# EAGLE design Volterra Carriage Board (EAGLE 9.1.3)
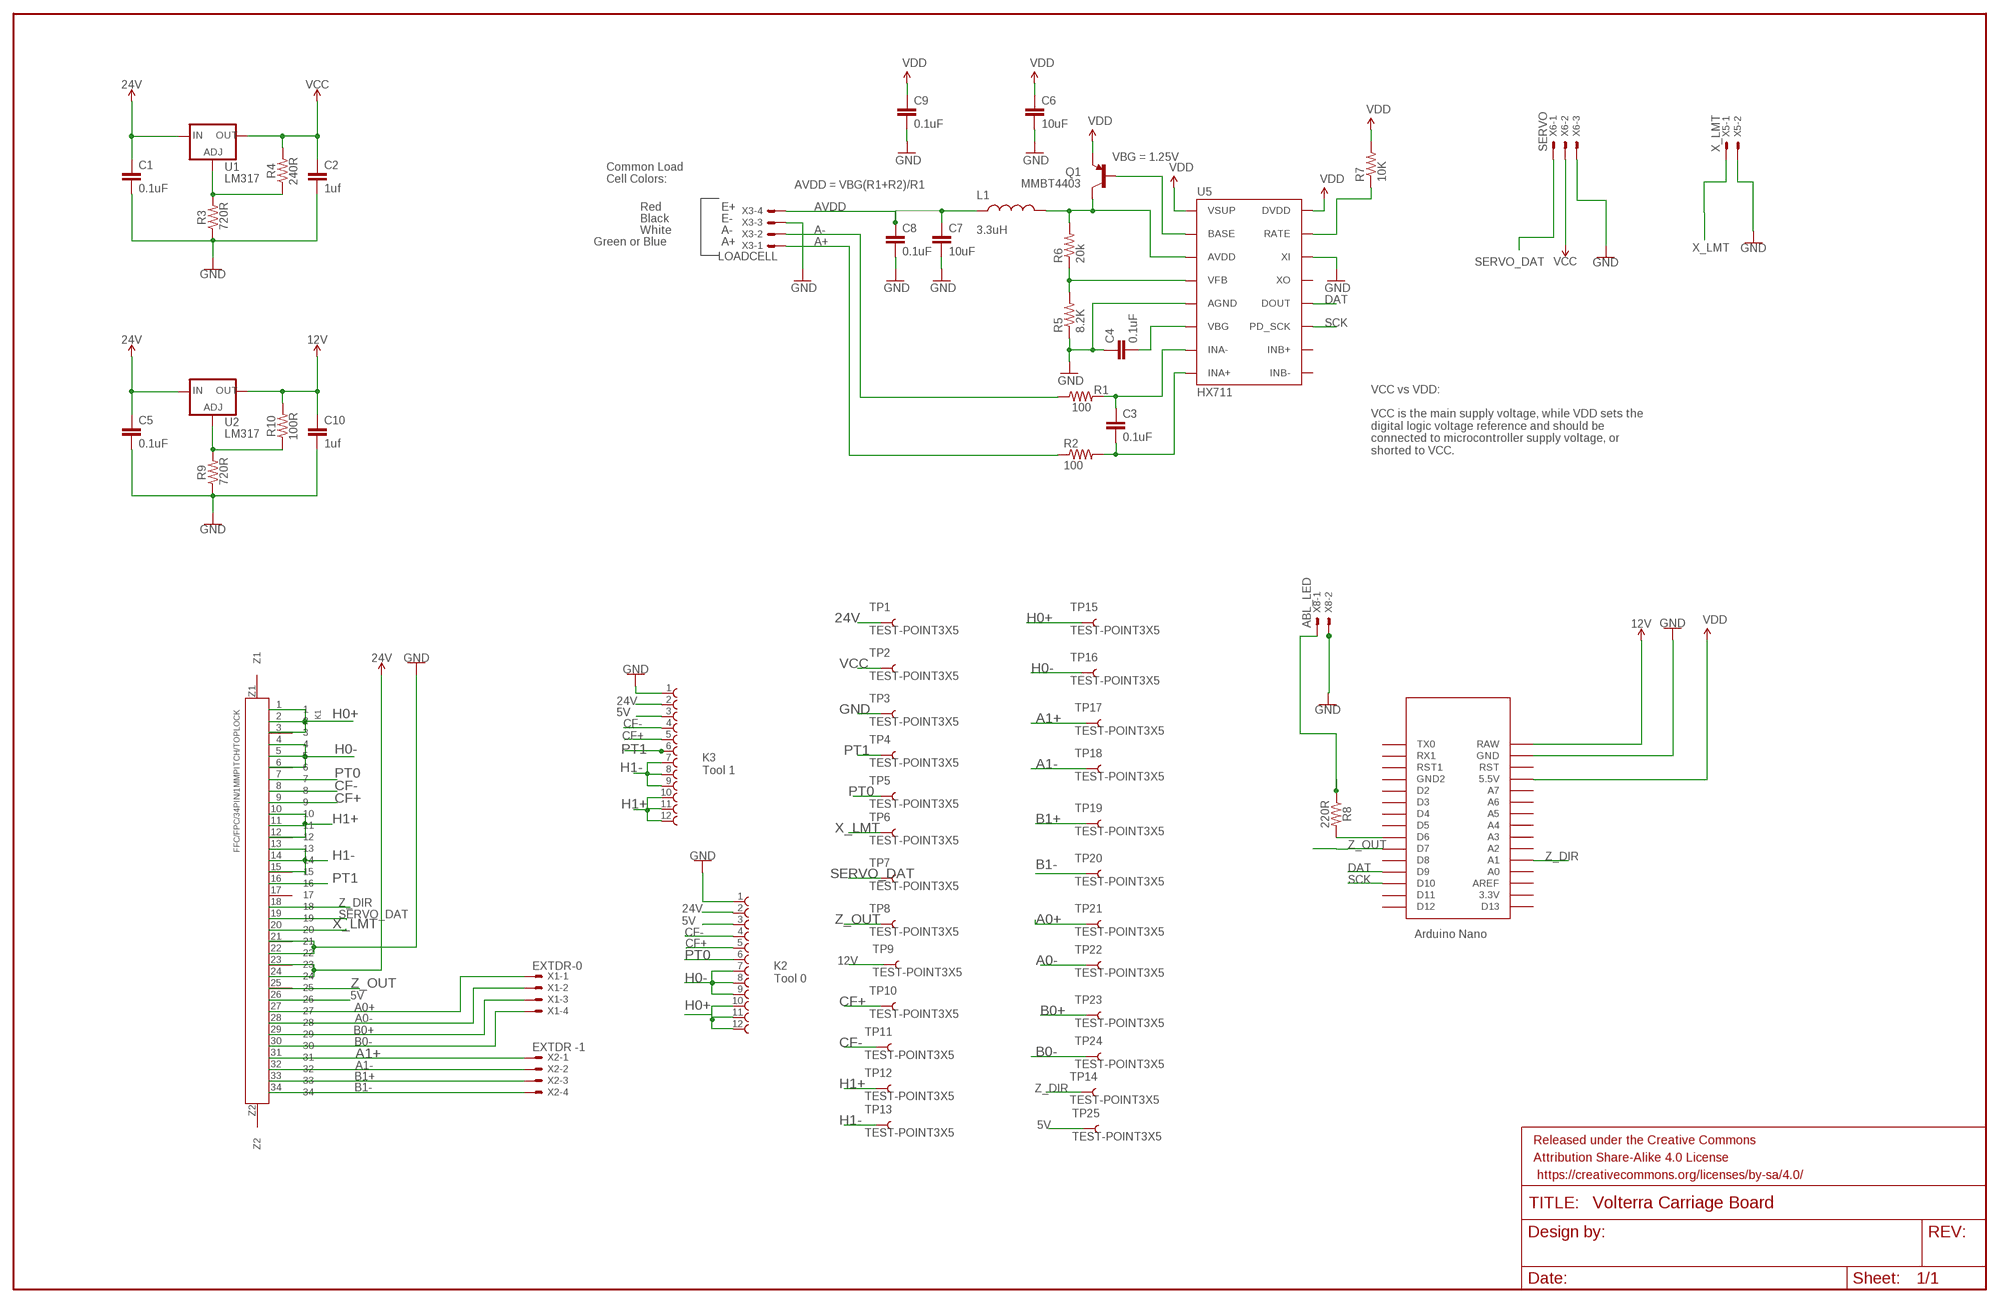
[diagram p0: schematic, sheet 1]

## Parts
C1  0.1uF  9.0PF-0603-50V-10%  [0603]
C2  1uf  9.0PF-0603-50V-10%  [0603]
C3  0.1uF  0.1UF-25V-5%(0603)  [0603-CAP]
C4  0.1uF  0.1UF-25V-5%(0603)  [0603-CAP]
C5  0.1uF  9.0PF-0603-50V-10%  [0603]
C6  10uF  10UF50V20%(1210)  [1210]
C7  10uF  10UF50V20%(1210)  [1210]
C8  0.1uF  0.1UF-25V-5%(0603)  [0603-CAP]
C9  0.1uF  0.1UF-25V-5%(0603)  [0603-CAP]
C10  1uf  9.0PF-0603-50V-10%  [0603]
FRAME1  FRAME-LEDGER  [CREATIVE_COMMONS]
K1  FFC/FPC/34PIN/1MMPITCH/TOPLOCK  [34PIN/1MMPITCH/FFC/FPC]
K2  Tool 0  68611214122  [68611214122]
K3  Tool 1  68611214122  [68611214122]
L1  3.3uH  INDUCTOR0805-IND  [0805]
Q1  MMBT4403  TRANSISTOR_PNPMMBT4403  [SOT23-3]
R1  100  100OHM-1/10W-1%(0603)  [0603-RES]
R2  100  100OHM-1/10W-1%(0603)  [0603-RES]
R3  720R  RESISTOR0603  [0603]
R4  240R  RESISTOR0603  [0603]
R5  8.2K  8.2KOHM-1/10W-5%(0603)  [0603-RES]
R6  20k  20KOHM1/10W1%(0603)  [0603-RES]
R7  10K  10KOHM-1/10W-1%(0603)0603  [0603-RES]
R8  220R  RESISTOR0603  [0603]
R9  720R  RESISTOR0603  [0603]
R10  100R  RESISTOR0603  [0603]
TP1  TEST-POINT3X5  [PAD.03X.05]
TP2  TEST-POINT3X5  [PAD.03X.05]
TP3  TEST-POINT3X5  [PAD.03X.05]
TP4  TEST-POINT3X5  [PAD.03X.05]
TP5  TEST-POINT3X5  [PAD.03X.05]
TP6  TEST-POINT3X5  [PAD.03X.05]
TP7  TEST-POINT3X5  [PAD.03X.05]
TP8  TEST-POINT3X5  [PAD.03X.05]
TP9  TEST-POINT3X5  [PAD.03X.05]
TP10  TEST-POINT3X5  [PAD.03X.05]
TP11  TEST-POINT3X5  [PAD.03X.05]
TP12  TEST-POINT3X5  [PAD.03X.05]
TP13  TEST-POINT3X5  [PAD.03X.05]
TP14  TEST-POINT3X5  [PAD.03X.05]
TP15  TEST-POINT3X5  [PAD.03X.05]
TP16  TEST-POINT3X5  [PAD.03X.05]
TP17  TEST-POINT3X5  [PAD.03X.05]
TP18  TEST-POINT3X5  [PAD.03X.05]
TP19  TEST-POINT3X5  [PAD.03X.05]
TP20  TEST-POINT3X5  [PAD.03X.05]
TP21  TEST-POINT3X5  [PAD.03X.05]
TP22  TEST-POINT3X5  [PAD.03X.05]
TP23  TEST-POINT3X5  [PAD.03X.05]
TP24  TEST-POINT3X5  [PAD.03X.05]
TP25  TEST-POINT3X5  [PAD.03X.05]
U1  LM317  V_REG_317SMD  [SOT223]
U2  LM317  V_REG_317SMD  [SOT223]
U5  HX711  HX711HX711  [SO16]
U$1  NANO  [NANO]
X1  EXTDR-0  JST-XH-04-PIN-LONG-PAD  [JST-XH-04-PACKAGE-LONG-PAD]
X2  EXTDR -1  JST-XH-04-PIN-LONG-PAD  [JST-XH-04-PACKAGE-LONG-PAD]
X3  LOADCELL  JST-XH-04-PIN-LONG-PAD  [JST-XH-04-PACKAGE-LONG-PAD]
X5  X_LMT  JST-XH-02-PIN-LONG-PAD  [JST-XH-02-PACKAGE-LONG-PAD]
X6  SERVO  JST-XH-03-PIN-LONG-PAD  [JST-XH-03-PACKAGE-LONG-PAD]
X8  ABL_LED  JST-XH-02-PIN-LONG-PAD  [JST-XH-02-PACKAGE-LONG-PAD]

## Nets
5V: K1.26 K2.3 K3.3 TP25.P$1
12V: C10.1 R10.2 TP9.P$1 U2.2(OUT) U$1.RAW
24V: C1.1 C5.1 K1.23 K1.24 K2.2 K3.2 TP1.P$1 U1.3(IN) U2.3(IN)
A0+: K1.27 TP21.P$1 X1.1
A0-: K1.28 TP22.P$1 X1.2
A1+: K1.31 TP17.P$1 X2.1
A1-: K1.32 TP18.P$1 X2.2
A+: R2.1 X3.1
A-: R1.1 X3.2
ADJ: R3.2 R4.1 U1.1(ADJ)
ADJ1: R9.2 R10.1 U2.1(ADJ)
AVDD: C7.1 C8.1 L1.1 X3.4
B0+: K1.29 TP23.P$1 X1.3
B0-: K1.30 TP24.P$1 X1.4
B1+: K1.33 TP19.P$1 X2.3
B1-: K1.34 TP20.P$1 X2.4
CF+: K1.9 K2.5 K3.5 TP10.P$1
CF-: K1.8 K2.4 K3.4 TP11.P$1
DAT: U5.12(DOUT) U$1.D9
GND: C1.2 C2.2 C4.1 C5.2 C6.2 C7.2 C8.2 C9.2 C10.2 K1.21 K1.22 K2.1 K3.1 R3.1 R5.1 R9.1 TP3.P$1 U5.5(AGND) U5.14(XI) U$1.GND X3.3 X5.2 X6.3 X8.2
H0+: K1.1 K1.2 K1.3 K2.10 K2.11 K2.12 TP15.P$1
H0-: K1.4 K1.5 K1.6 K2.7 K2.8 K2.9 TP16.P$1
H1+: K1.10 K1.11 K1.12 K3.10 K3.11 K3.12 TP12.P$1
H1-: K1.13 K1.14 K1.15 K3.7 K3.8 K3.9 TP13.P$1
N$1: R8.2 U$1.D6
N$2: R7.1 U5.15(RATE)
N$3: C3.1 R1.2 U5.7(INA-)
N$4: Q1.1(B) U5.2(BASE)
N$5: L1.2 Q1.3(C) R6.2 U5.3(AVDD)
N$6: R5.2 R6.1 U5.4(VFB)
N$7: C4.2 U5.6(VBG)
N$8: C3.2 R2.2 U5.8(INA+)
N$14: R8.1 X8.1
PT0: K1.7 K2.6 TP5.P$1
PT1: K1.16 K3.6 TP4.P$1
SCK: U5.11(PD_SCK) U$1.D10
SERVO_DAT: K1.19 TP7.P$1 X6.1
VCC: C2.1 R4.2 TP2.P$1 U1.2(OUT) X6.2
VDD: C6.1 C9.1 Q1.2(E) R7.2 U5.1(VSUP) U5.16(DVDD) U$1.5V(5.5V)
X_LMT: K1.20 TP6.P$1 X5.1
Z_DIR: K1.18 TP14.P$1 U$1.A1
Z_OUT: K1.25 TP8.P$1 U$1.D7
Unconnected: K1.17 K1.Z1 K1.Z2 U5.9(INB-) U5.10(INB+) U5.13(XO) U$1.3.3V U$1.A0 U$1.A2 U$1.A3 U$1.A4 U$1.A5 U$1.A6 U$1.A7 U$1.AREF U$1.D2 U$1.D3 U$1.D4 U$1.D5 U$1.D8 U$1.D11 U$1.D12 U$1.D13 U$1.GND1(GND2) U$1.ICSP1 U$1.ICSP2 U$1.ICSP3 U$1.ICSP4 U$1.ICSP5 U$1.ICSP6 U$1.RST U$1.RST1 U$1.RX1 U$1.TX0

## Notes on the sheet
- VBG = 1.25V
- Common Load
  Cell Colors:
- AVDD = VBG(R1+R2)/R1
- Red | E+
- Black | E-
- White | A-
- Green or Blue | A+
- VCC vs VDD:
  
  VCC is the main supply voltage, while VDD sets the
  digital logic voltage reference and should be
  connected to microcontroller supply voltage, or
  shorted to VCC.
- C:/Users/Vijay/Dropbox/FracktalWorks/Design & Marketing Colaterals/Box Logo.bmp | C:/Users/Vijay/Dropbox/FracktalWorks/Design & Marketing Colaterals/Box Logo.bmp

## Library data of the parts
C1 C2 C5 C10 = SparkFun-Capacitors:9.0PF: 9.0pF ceramic capacitors A capacitor is a passive two-terminal electrical component used to store electrical energy temporarily in an electric field.; PROD_ID: CAP-09341; VALUE: 9.0pF
C3 C4 C8 C9 = SparkFun-Capacitors:0.1UF-25V-5%(0603): CAP-08604; PROD_ID: CAP-08604
C6 C7 = SparkFun-Capacitors:10UF50V20%(1210): CAP-09824; PROD_ID: CAP-09824
FRAME1 = SparkFun-Aesthetics:FRAME-LEDGER: Schematic Frame - Ledger Standard 11x14 US Ledger frame
K1 = FracktalWorks_Eagle_Library:FFC/FPC/34PIN/1MMPITCH/TOPLOCK
K2 K3 = Wurth_Elektronik_Electromechanic_FPC_Connectors_&_Flat_Flexible_Cable_rev15b:68611214122: WR-FPC 1.00mm SMT ZIF Horizontal Top Contact, 12 Pins=>Code : Con_FPC_ZIF_1.00_68611214122 <http://katalog.we-online.de/media/images/eican/Con_FPC_ZIF_1.00_6861xx14122_pf2.jpg> Details see: http://katalog.we-online.de/en/em/686_1xx_141_22 Created 2014-07-09, Karrer Zheng 2014 (C) Würth Elektronik
L1 = SparkFun-Passives:INDUCTOR: Inductors Basic Inductor/Choke - 0603 and 1206. Footprints are not proven and vary greatly between part numbers. INDUCTOR POWER 3.3UH 4.0A SMD 0.197" L x 0.197" W x 0.177" H (5.00mm x 5.00mm x 4.50mm); PROD_ID: NDUC-13076
Q1 = SparkFun-DiscreteSemi:TRANSISTOR_PNP: Generic PNP BJT Double check pinouts against datasheets- not all devices are the same! MMBT3906 - 40V 200mA SOT-23 (TRANS-08052) MMBT4403 - 40V 600mA SOT-23 (TRANS-09245); PROD_ID: TRANS-09245
R1 R2 = SparkFun-Resistors:100OHM-1/10W-1%(0603): RES-07863; PROD_ID: RES-07863
R3 R4 R8-R10 = SparkFun-Resistors:RESISTOR: Generic Resistor Package
R5 = SparkFun-Resistors:8.2KOHM-1/10W-5%(0603): RES-10646; PROD_ID: RES-10646
R6 = SparkFun-Resistors:20KOHM1/10W1%(0603): RES-09383; PROD_ID: RES-09383
R7 = SparkFun-Resistors:10KOHM-1/10W-1%(0603): RES-00824; PROD_ID: RES-00824
TP1-TP25 = SparkFun-Connectors:TEST-POINT: SparkFun Test Points Bare copper test points for troubleshooting or In-Circuit-Testing. These are used by our Production team for verifying production board runs using pogo-pins on test beds. SparkFun Products: SparkFun LSM9DS1 Breakout <https://www.sparkfun.com/products/13284> SparkFun PSOC <https://www.sparkfun.com/products/13714> SparkFun Load Cell Amplifier <https://www.sparkfun.com/products/13879>
U1 U2 = SparkFun-IC-Power:V_REG_317: Voltage Regulator Standard LM317 adjustable voltage regulator. AOI (Adjust Output Input). Google 'LM317 Calculator' for easy to use app to get the two resistor values needed. 240/720 for 5V output. 240/390 for 3.3V output. Spark Fun Electronics SKU : COM-00527
U5 = Testing:HX711; PROD_ID: IC-12445
U$1 = Arduino-clone:NANO: Arduino Nano
X1-X3 = Rembrandt Electronics - JST XH Connectors v1-0:JST-XH-04-PIN: JST XH Connector 2 Pin Wire to board connector. Pitch: 2,54 mm, (0.100") Number of pins: 4 Created by Rembrandt Electronics www.rembrandtelectronics.com
X5 X8 = Rembrandt Electronics - JST XH Connectors v1-0:JST-XH-02-PIN: JST XH Connector 2 Pin Wire to board connector. Pitch: 2,54 mm, (0.100") Number of pins: 2 Created by Rembrandt Electronics www.rembrandtelectronics.com
X6 = Rembrandt Electronics - JST XH Connectors v1-0:JST-XH-03-PIN: JST XH Connector 2 Pin Wire to board connector. Pitch: 2,54 mm, (0.100") Number of pins: 3 Created by Rembrandt Electronics www.rembrandtelectronics.com

## Net classes
0 default: width 0.305 mm

## Board
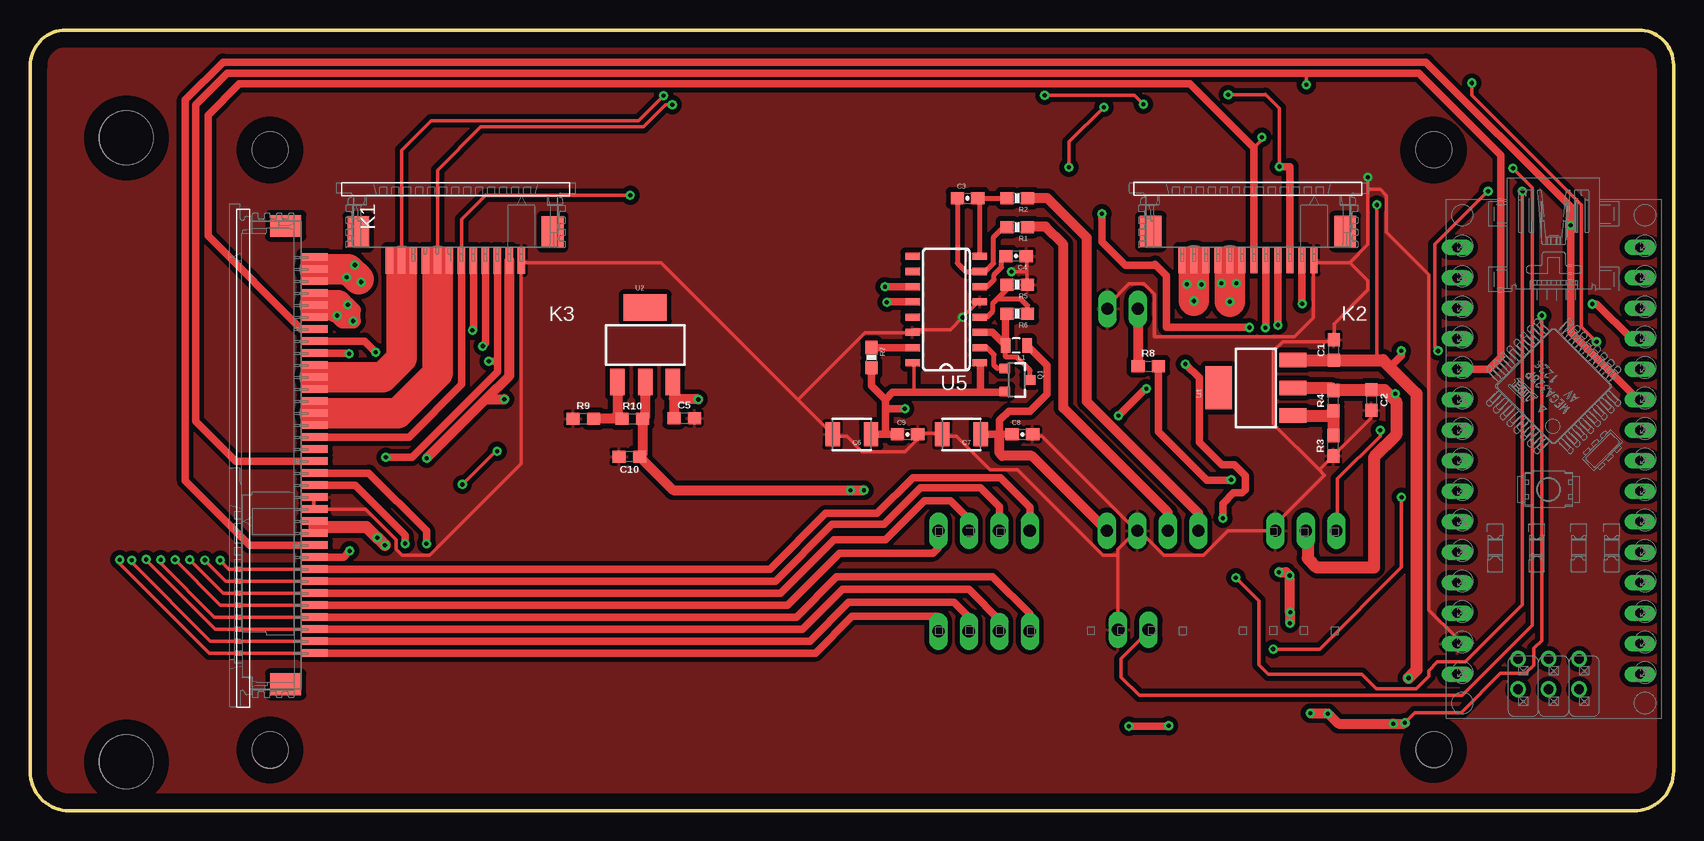
[diagram p1: board, top side]
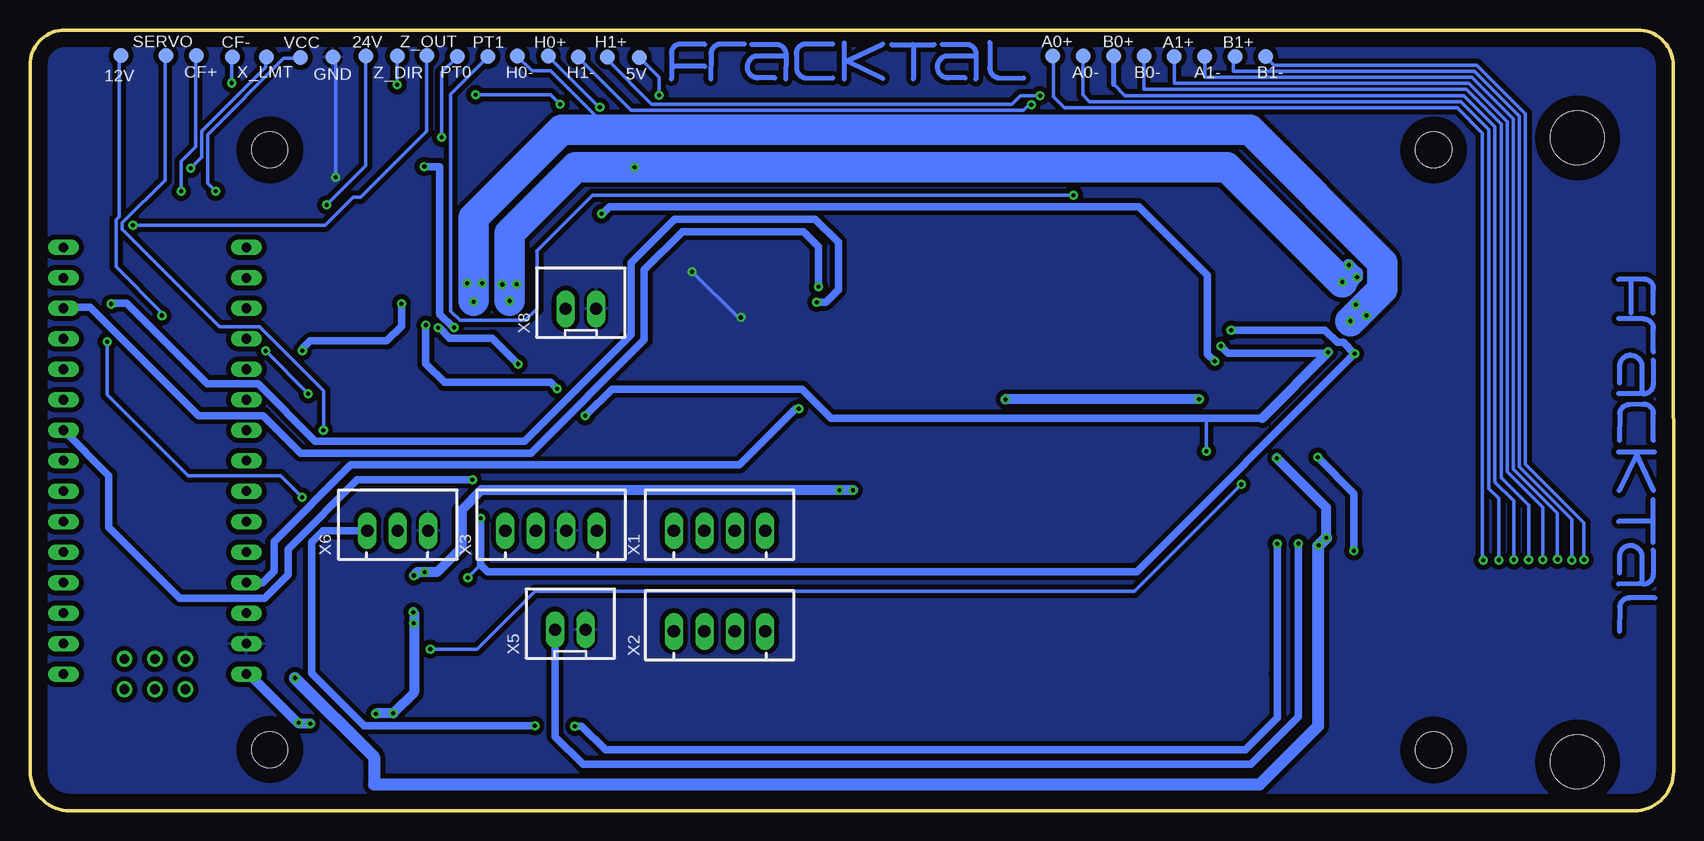
[diagram p2: board, bottom side, seen from below]

Size 137.01 x 65.07 mm. Coordinates in mm from the lower left corner, seen from the top.
Outline: 3,65.07 134.09,65.07 arc-90 137.01,62.15 137.01,3.33 arc-90 133.68,0 3.3,0 arc-90 0,3.3 0.03,62.1 arc-90 3,65.07
Copper layers (1*16): Top 0.035mm / dielectric 1.5mm / Bottom 0.035mm
Design rules "LionCircuits *": minimum track width 8mil, minimum drill 0.35mm, track to track 8mil, track to pad 8mil, pad to pad 8mil, via to via 8mil, smd to smd 8mil, copper to edge 50mil, drill to drill 10mil, minimum pad ring 10mil, minimum via ring 8mil, stop-mask expansion 4mil, vias tented up to drill 0mil, thermal gap 10mil
Holes 3 mm at 20.02,55.09 20.02,5.08 117.02,5.11 117.02,55.09
Holes 4.5 mm at 8.03,56.08 8.03,4.09

### Footprints (pad centres in the part's own frame; a part is rotated, then mirrored left to right if it is on the bottom)
0603 = smd 1.1 x 1: 1 -0.85,0; 2 0.85,0
0603-CAP = smd 1.1 x 1: 1 -0.85,0; 2 0.85,0
1210 = smd 1.2 x 2: 1 -1.6,0; 2 1.6,0
34PIN/1MMPITCH/FFC/FPC = smd 0.6 x 2.2: 1 -14.43,2.1; 2 -13.43,2.1; 3 -12.43,2.1; 4 -11.43,2.1; 5 -10.43,2.1; 6 -9.43,2.1; 7 -8.43,2.1; 8 -7.43,2.1; 9 -6.43,2.1; 10 -5.43,2.1; 11 -4.43,2.1; 12 -3.43,2.1; 13 -2.43,2.1; 14 -1.43,2.1; 15 -0.43,2.1; 16 0.57,2.1; 17 1.57,2.1; 18 2.57,2.1; 19 3.57,2.1; 20 4.57,2.1; 21 5.57,2.1; 22 6.57,2.1; 23 7.57,2.1; 24 8.57,2.1; 25 9.57,2.1; 26 10.57,2.1; 27 11.57,2.1; 28 12.57,2.1; 29 13.57,2.1; 30 14.57,2.1; 31 15.57,2.1; 32 16.57,2.1; 33 17.57,2.1; 34 18.57,2.1 | smd 1.8 x 2.6: Z1 -17.03,-0.3; Z2 21.17,-0.3
68611214122 = smd 0.6 x 2.2: 1 -8.5,1.1; 2 -7.5,1.1; 3 -6.5,1.1; 4 -5.5,1.1; 5 -4.5,1.1; 6 -3.5,1.1; 7 -2.5,1.1; 8 -1.5,1.1; 9 -0.5,1.1; 10 0.5,1.1; 11 1.5,1.1; 12 2.5,1.1 | smd 1.8 x 2.6: Z1 -11.1,-1.3; Z2 5.1,-1.3
0805 = smd 0.8 x 1.2: 1 -0.9,0; 2 0.9,0
SOT23-3 = smd 0.8 x 0.9: 1 -0.95,-1; 2 0.95,-1; 3 0,1.1
0603-RES = smd 1.1 x 1: 1 -0.85,0; 2 0.85,0
PAD.03X.05 = smd 1.27 x 1.27: P$1 0,0
SOT223 = smd 1.219 x 2.235: 1 -2.311,-3.099; 2 0,-3.099; 3 2.311,-3.099 | smd 3.6 x 2.2: 4 0,3.099
SO16 = smd 0.6 x 1.2: 1 -4.445,-2.8; 2 -3.175,-2.8; 3 -1.905,-2.8; 4 -0.635,-2.8; 5 0.635,-2.8; 6 1.905,-2.8; 7 3.175,-2.8; 8 4.445,-2.8; 9 4.445,2.8; 10 3.175,2.8; 11 1.905,2.8; 12 0.635,2.8; 13 -0.635,2.8; 14 -1.905,2.8; 15 -3.175,2.8; 16 -4.445,2.8
NANO = drill 0.8 long: 3.3V -10.16,24.13; 5V -10.16,-1.27; A0 -10.16,19.05; A1 -10.16,16.51; A2 -10.16,13.97; A3 -10.16,11.43; A4 -10.16,8.89; A5 -10.16,6.35; A6 -10.16,3.81; A7 -10.16,1.27; AREF -10.16,21.59; D2 5.08,1.27; D3 5.08,3.81; D4 5.08,6.35; D5 5.08,8.89; D6 5.08,11.43; D7 5.08,13.97; D8 5.08,16.51; D9 5.08,19.05; D10 5.08,21.59; D11 5.08,24.13; D12 5.08,26.67; D13 -10.16,26.67; GND -10.16,-6.35; GND1 5.08,-1.27; RAW -10.16,-8.89; RST -10.16,-3.81; RST1 5.08,-3.81; RX1 5.08,-6.35; TX0 5.08,-8.89 | drill 0.8: ICSP1 -5.08,-10.16; ICSP2 -5.08,-7.62; ICSP3 -2.54,-10.16; ICSP4 -2.54,-7.62; ICSP5 0,-10.16; ICSP6 0,-7.62
JST-XH-04-PACKAGE-LONG-PAD = drill 1.016 long: 1 -3.81,0; 2 -1.27,0; 3 1.27,0; 4 3.81,0
JST-XH-02-PACKAGE-LONG-PAD = drill 1.016 long: 1 -1.27,0; 2 1.27,0
JST-XH-03-PACKAGE-LONG-PAD = drill 1.016 long: 1 -2.54,0; 2 0,0; 3 2.54,0

### Placement (x,y rotation side)
C1  108.69,38.4 90 top
C2  111.81,34.24 270 top
C3  78.16,51.05 0 top
C4  82.19,46.23 180 top
C5  54.53,32.74 0 top
C6  68.5,31.37 180 top
C7  77.65,31.37 180 top
C8  82.73,31.37 0 top
C9  73.15,31.37 0 top
C10  49.96,29.51 180 top
FRAME1  20.27,-8.61 0 top  (outside the outline)
K1  21.62,31.72 270 top
K2  98.53,46.99 180 top
K3  32.46,46.96 180 top
L1  82.22,38.79 180 top
Q1  82.25,35.92 270 top
R1  82.3,48.64 180 top
R2  82.3,51.05 180 top
R3  108.64,30.43 90 top
R4  108.66,34.19 90 top
R5  82.3,43.84 180 top
R6  82.3,41.43 180 top
R7  70.13,37.77 270 top
R8  93.22,37.06 0 top
R9  46.13,32.69 0 top
R10  50.22,32.66 0 top
TP1  109.02,62.89 0 bottom
TP2  114.48,62.79 0 bottom
TP3  111.76,62.81 0 bottom
TP4  98.83,62.87 0 bottom
TP5  101.37,62.87 0 bottom
TP6  117.3,62.84 180 bottom
TP7  125.68,62.97 180 bottom
TP8  103.94,62.94 180 bottom
TP9  129.41,62.94 0 bottom
TP10  123.14,62.94 180 bottom
TP11  120.14,62.81 180 bottom
TP12  88.87,62.81 0 bottom
TP13  91.31,62.81 0 bottom
TP14  106.4,62.89 180 bottom
TP15  93.8,62.89 0 bottom
TP16  96.39,62.89 0 bottom
TP17  41.63,62.87 180 bottom
TP18  39.09,62.87 180 bottom
TP19  36.55,62.87 180 bottom
TP20  34.01,62.87 180 bottom
TP21  51.74,62.92 180 bottom
TP22  49.2,62.92 180 bottom
TP23  46.66,62.92 180 bottom
TP24  44.12,62.92 180 bottom
TP25  86.23,62.79 0 bottom
U1  102.18,35.26 90 top
U2  51.28,38.84 0 top
U5  76.38,41.78 90 top
U$1  129.13,20.29 0 top
U$2  [FRACKTALLOGO]  4.67,32.31 270 bottom
U$3  [FRACKTALLOGO]  71.55,60.91 0 bottom
X1  79.53,23.34 0 bottom
X2  79.53,14.96 0 bottom
X3  93.57,23.34 0 bottom
X5  91.97,15.09 0 bottom
X6  106.35,23.34 0 bottom
X8  91.08,41.83 0 bottom

### Tracks (layer width: path | path; a pad name or v marks a point on that pad's centre or on a via)
5V  (via drill 0.35)
  Top 0.305: v104.14,53.7 104.14,58.57 103,59.72 102.97,59.69 v99.87,59.69 | v92.81,58.88 92.05,59.64 v84.58,59.64
  Top 0.61: 38.97,37.49 38.97,41.94 K3.3 | 38.97,37.49 38.28,37.49 v38.25,37.46 | v89.36,49.76 89.36,47.45 91.31,45.49 93.7,45.49 93.78,45.57 94.74,44.6 94.74,40.28 v101.65,40.28 | v104.14,53.7 105.03,53.7 K2.3 | K1.26 26.13,21.15 v26.64,21.67 | v29.67,29.46 31.85,29.46 38.97,36.58 38.97,37.49
  Bottom 0.305: v99.87,59.69 93.62,59.69 v92.81,58.88 | v84.58,59.64 84.58,61.14 TP25.P$1
  Bottom 0.61: v89.36,49.76 89.28,49.76 88.7,50.34 44.55,50.34 38.86,44.65 38.86,38.07 v38.25,37.46 | v104.14,53.7 102.84,53.7 102.84,41.38 101.75,40.28 v101.65,40.28 | v26.64,21.67 26.64,26.44 v29.67,29.46
12V  (via drill 0.35)
  Top 0.305: v126.01,41.27 126.01,14.2 125.35,13.54 125.35,12.14 124.66,11.46 122.58,11.46 119.3,8.18 115.42,8.18 114.83,7.59 v114.6,7.34
  Top 0.813: U2.2 51.28,32.88 R10.2 51.07,29.77 C10.1 53.61,26.72 v69.52,26.72 | v104.11,19.89 104.72,19.89 v105,19.61 105,16.61 v105.05,16.56 105.03,16.54 v105.03,15.65 | v106.73,8.13 108.2,8.13 109.07,7.26 v113.64,7.26 114.53,7.26 v114.6,7.34
  Bottom 0.305: TP9.P$1 129.57,62.71 129.57,49.5 129.82,49.25 129.82,45.34 126.01,41.53 v126.01,41.27
  Bottom 0.813: v105,19.61 104.72,19.89 103.07,19.89 101.04,21.92 101.04,25.07 99.39,26.72 v69.52,26.72 v68.4,26.72 | U$1.RAW 118.75,11.4 114.6,7.26 v113.64,7.26 | v105.05,16.56 105,16.51 105,9.86 v106.73,8.13 108.15,8.13 v108.18,8.1
24V  (via drill 0.35)
  Top 0.305: v112.27,50.5 112.27,38.07 112.79,37.55
  Top 0.61: K1.24 23.72,23.67 K1.23 | v114.3,38.35 114.3,37.92 113.36,36.98 | K2.2 106.03,42.28 v106.05,42.27
  Top 0.813: v33.07,29.39 37.97,34.29 | 37.97,34.29 39.96,36.28 K3.2 | U2.3 53.68,35.65 53.68,34.37 | 53.68,34.37 C5.1 | 37.97,34.29 39.52,34.29 v39.55,34.32 | v55.7,34.29 53.76,34.29 53.68,34.37
  Top 1.016: U1.3 108.67,37.57 C1.1 112.79,37.55 113.36,36.98 115.57,34.77 115.57,11.73 v114.91,11.07 | 23.72,23.67 28.04,23.67 v28.96,22.76 28.98,22.76 v29.59,22.15
  Bottom 0.305: TP1.P$1 109.02,53.75 v112.27,50.5
  Bottom 0.61: v106.05,42.27 106.05,40.39 107.26,39.17 113.64,39.17 114.3,38.51 v114.3,38.35
  Bottom 0.813: v28.96,22.76 28.96,25.27 v33.07,29.39 | v39.55,34.32 55.68,34.32 v55.7,34.29
  Bottom 1.016: v28.96,22.76 29.64,22.07 29.64,7.06 34.49,2.21 108.33,2.21 108.33,4.5 v114.91,11.07
A0+  (via drill 0.35)
  Top 0.305: K1.27 16.57,20.15 v15.85,20.88
  Top 0.61: K1.27 61.68,20.15 66.32,24.79 70.61,24.79 73.58,27.76 80.9,27.76 83.34,25.32 X1.1
  Bottom 0.305: 51.69,62.43 51.69,59.51 50.77,58.6 18.03,58.6 15.93,56.49 15.93,20.95 v15.85,20.88
  Bottom 0.406: 51.69,62.43 51.74,62.48 TP21.P$1
A0-  (via drill 0.35)
  Top 0.305: K1.28 16.33,19.15 v14.58,20.9
  Top 0.61: K1.28 62.13,19.15 66.85,23.88 71.2,23.88 74.24,26.92 79.22,26.92 80.8,25.35 X1.2
  Bottom 0.305: v14.58,20.9 14.58,26.03 15.39,26.85 15.39,56.77 17.73,59.11 48.69,59.11 49.25,59.66 49.25,62.86
  Bottom 0.406: 49.25,62.86 TP22.P$1
A1+  (via drill 0.35)
  Top 0.305: K1.31 15.37,16.15 10.9,20.62 v10.9,20.93
  Top 0.61: K1.31 63.88,16.15 67.23,19.51 80.24,19.51 83.34,16.41 X2.1
  Bottom 0.305: v10.9,20.93 10.9,25.3 13.87,28.27 13.87,57.45 17.05,60.63 41.61,60.63 41.61,62.84
  Bottom 0.406: 41.61,62.84 TP17.P$1
A1-  (via drill 0.35)
  Top 0.305: K1.32 15.45,15.15 9.66,20.94 v9.68,20.95
  Top 0.61: K1.32 64.41,15.15 67.72,18.47 78.26,18.47 80.95,15.77 80.95,15.11 X2.2
  Bottom 0.305: v9.68,20.95 9.68,24.8 13.36,28.48 13.36,57.66 16.84,61.14 39.07,61.14 39.09,61.16 TP18.P$1
A+
  Top 0.813: X3.1 97.38,24.82 88.09,34.11 88.09,47.78 84.81,51.05 R2.1
A-
  Top 0.813: X3.2 94.84,24.87 86.13,33.58 86.13,47.22 84.66,48.69 83.2,48.69 R1.1
ADJ
  Top 1.016: U1.1 108.27,32.94 R4.1 108.66,31.3 R3.2
ADJ1
  Top 0.813: U2.1 48.97,33.06 R10.1 47,32.66 R9.2
AVDD
  Top 0.61: C7.1 80.82,31.37 | 80.82,31.37 C8.1 | 80.82,31.37 80.82,32.54 81.61,33.32 83.36,33.32 84.76,34.72 84.76,37.15 L1.1
  Top 0.813: X3.4 83.52,29.59 81.05,29.59 80.82,29.82 80.82,31.37
B0+  (via drill 0.35)
  Top 0.305: K1.29 16.08,18.15 v13.31,20.93
  Top 0.61: K1.29 62.55,18.15 67.01,22.61 71.32,22.61 74.55,25.83 76.73,25.83 78.26,24.31 X1.3
  Bottom 0.305: v13.31,20.93 13.31,25.83 14.88,27.41 14.88,56.99 17.5,59.61 45.72,59.61 46.66,60.55
  Bottom 0.406: 46.66,60.55 TP23.P$1
B0-  (via drill 0.35)
  Top 0.305: K1.30 15.87,17.15 v12.09,20.93
  Top 0.61: K1.30 63.13,17.15 67.46,21.49 75.26,21.49 75.72,21.95 X1.4
  Bottom 0.305: v12.09,20.93 12.09,25.47 14.38,27.76 14.38,57.22 17.28,60.12 44.15,60.12 44.15,62.89
  Bottom 0.406: 44.15,62.89 TP24.P$1
B1+  (via drill 0.35)
  Top 0.305: K1.33 15.03,14.15 8.48,20.7 v8.48,20.88
  Top 0.61: K1.33 65.01,14.15 68.22,17.37 77.04,17.37 78.26,16.15 X2.3
  Bottom 0.305: v8.48,20.88 8.48,24.32 12.85,28.69 12.85,57.87 16.63,61.65 36.68,61.65 36.68,62.74 TP19.P$1
B1-  (via drill 0.35)
  Top 0.305: K1.34 14.94,13.15 7.44,20.65 7.44,20.9 v7.47,20.93
  Top 0.61: K1.34 65.48,13.15 68.53,16.21 75.64,16.21 76,15.85 75.64,15.49 75.64,14.43 75.72,14.5 X2.4
  Bottom 0.305: v7.47,20.93 7.47,24.02 12.34,28.9 12.34,58.08 16.42,62.15 33.3,62.15 TP20.P$1
CF+  (via drill 0.35)
  Top 0.305: v124.41,51.64 124.41,17.17 119.66,12.42 117.32,12.42 116.59,11.68 116.59,11.2 115.57,10.19 112.22,10.19 111.02,11.38 103.23,11.38 102.44,12.17 102.44,15.01 102.44,17.5 v100.51,19.43
  Top 0.61: K1.9 26.54,38.15 v26.59,38.1 | v36.88,40.06 36.96,40.14 K3.5 | K2.5 103.03,40.31 v102.98,40.26 | v96.32,37.24 97.48,36.08 97.48,30.72 99.34,28.85 100.38,28.85 101.3,27.94 101.3,27.25 101.3,26.8 101.32,26.77 101.04,26.49 100.33,26.49 99.44,25.6 v99.44,24.38
  Bottom 0.305: 123.22,62.71 TP10.P$1 123.22,62.71 | 123.22,62.71 123.22,55.35 124.41,54.15 v124.41,51.64 | 99.44,20.5 v100.51,19.43
  Bottom 0.61: v36.88,40.06 29.06,40.06 28.04,39.04 27.53,39.04 v26.59,38.1 44.75,19.94 98.88,19.94 99.44,20.5 v99.44,24.38 | v102.98,40.26 102.88,40.26 102.02,39.4 98.48,39.4 v96.32,37.24
CF-  (via drill 0.35)
  Top 0.305: v120.19,60.66 120.19,59.64 129.31,50.52 129.31,40.36 v130.58,39.09 | v114.33,26.14 114.33,20.29 107.52,13.49 v103.63,13.49 | v36.04,27.2 38.81,29.97 v38.94,29.97
  Top 0.61: K1.8 27.88,39.15 v28.8,38.23 | v37.74,38.73 37.96,38.95 K3.4 | v90.73,32.92 92.99,35.18 v93.07,35.18 | v104.01,40.49 104.01,45.88 K2.4
  Bottom 0.305: v120.19,60.66 120.19,62.61 120.17,62.71 TP11.P$1 | v130.58,39.09 130.58,34.67 123.83,27.91 116.1,27.91 v114.33,26.14 | v103.63,13.49 99.72,13.49 94.92,18.29 44.96,18.29 v36.04,27.2 | v38.94,29.97 38.94,32.64 38.84,32.74
  Bottom 0.61: 34.29,32.74 38.84,32.74 70.23,32.74 72.64,35.15 88.49,35.15 v90.73,32.92 | v37.74,38.73 37.13,38.13 28.93,38.13 28.83,38.23 v28.8,38.23 | v93.07,35.18 93.6,35.71 102.46,35.71 104.01,37.26 v104.01,40.49
  Bottom 0.813: v28.8,38.23 34.29,32.74
DAT  (via drill 0.35)
  Top 0.61: U5.12 71.45,42.42 v71.42,42.39 | U$1.D9 133.5,39.34 130.61,42.24 v130.23,42.24
  Bottom 0.61: v71.42,42.39 70.66,42.39 69.62,43.43 69.62,47.37 71.55,49.3 83.26,49.3 86.89,45.67 86.89,39.67 95.76,30.81 113.22,30.81 117.99,35.58 122.22,35.58 128.93,42.29 130.23,42.29 v130.23,42.24
GND  (via drill 0.35)
  Top 0.305: 83.08,44.93 83.08,46.2 C4.1 | 83.08,44.93 83.08,43.92 R5.1 | U5.5 79.02,42.39 v77.75,41.12 76.73,40.11 73.69,40.11 U5.14 73.43,39.85 69.62,39.85 64.03,34.26 | v81.81,44.93 83.08,44.93 | K1.21 23.65,26.14 23.65,25.37 K1.22 23.9,25.12 27.97,25.12 30.51,22.58 30.51,21.82 31.01,21.31 33.3,21.31 40.92,28.93 40.92,45.69 K3.1 41.17,45.69 52.6,45.69 64.03,34.26 | 64.03,34.26 66.83,31.47 C6.2 67.08,31.22 68.1,31.22 69.37,29.95 72.92,29.95 74,31.03 C9.2 74.02,31.47 75.97,31.47 C7.2 76.23,31.22 77.24,31.22 80.04,28.42 82.32,28.42 89.43,21.31 90.7,21.31 | C2.2 111.79,33.25 111.79,32.74 108.74,29.69 R3.1 108.48,29.44 107.47,28.42 | 92.23,23.34 84.35,31.22 83.59,31.22 C8.2 | 90.7,21.31 90.7,21.82 92.23,23.34 | 90.7,21.31 X5.2 | 92.23,23.34 X3.3 92.48,23.34 94.51,21.31 97.82,21.31 99.85,23.34 X6.3 103.91,23.34 103.91,23.98 107.91,27.98 107.47,28.42 | 110.01,45.69 111.53,44.17 111.53,43.41 108.74,40.61 108.74,39.34 C1.2 108.48,39.09 104.42,39.09 103.66,38.33 103.66,32.23 107.47,28.42 | 110.01,45.69 107.21,45.69 K2.1 106.96,45.69 106.96,41.1 105.38,39.52 93.73,39.52 93.73,43.05 92.86,43.92 91.62,43.92 89.81,42.11 X8.2 | 111.53,51.79 111.53,47.22 110.01,45.69 | 111.53,51.79 v111.53,52.81 | 111.53,51.79 112.55,51.79 113.06,51.28 113.06,48.23 116.61,44.68 116.61,16.74 118.9,14.45 118.9,13.94 U$1.GND
  Bottom 0.305: v81.81,44.93 78,41.12 v77.75,41.12 | v111.53,52.81 111.53,62.71 TP3.P$1
  pour Top (isolate 0.406): -0.05,65.13 137.29,65.13 137.29,0.2 -0.05,0.2 -0.05,65.1
  pour Bottom (isolate 0.406): -0.08,65.15 137.11,65.15 137.11,0.23 -0.08,0.23
H0+  (via drill 0.35)
  Top 0.305: v89.51,58.65 86.61,55.75 v86.61,53.64 | K2.12 96.04,45.95 K2.11 98.07,45.95 K2.10 | v27.61,44.07 27.71,44.17 27.38,44.3
  Top 0.61: K1.1 K1.2 K1.3
  Top 2.54: K1.2 26.52,45.15 27.38,44.3 | v97.03,42.49 K2.11
  Bottom 0.305: TP15.P$1 89.56,58.65 v89.51,58.65
  Bottom 0.813: v96.44,43.89 97.61,43.89
  Bottom 1.016: v97.64,43.87 97.61,43.89 97.03,43.89 | v27.61,44.07 27.61,44.96 v27.08,45.49 26.39,44.81 v26.39,44.48 26.8,44.07 v27.61,44.07
  Bottom 2.54: v27.61,44.07 27.66,44.07 37.24,53.64 v86.61,53.64 91.52,53.64 97.03,48.13 97.03,43.89 v97.03,42.49
H0-  (via drill 0.35)
  Top 0.305: K2.9 99.09,45.95 K2.8 101.12,45.95 K2.7
  Top 0.61: K1.6 K1.5 K1.4
  Top 1.27: 25.64,41.93 25.84,41.93 v26.95,40.82 | v26.95,40.82 26.95,41.73 v26.49,42.19 | v26.95,40.82 26.06,40.82 v25.6,41.27
  Top 2.54: v100.03,42.42 K2.8 | 25.64,41.93 25.64,42.15 K1.5
  Bottom 0.305: TP16.P$1 95.17,61.67 93.62,61.67 89.71,57.76 89.71,57.48 90.45,56.74 92.71,56.74
  Bottom 0.813: v100.56,43.97 v99.31,43.97 99.31,43.13 v100.03,42.42
  Bottom 1.016: v99.31,43.97 100.03,43.97
  Bottom 2.54: v26.95,40.82 24.28,43.48 24.28,45.69 35.33,56.74 92.71,56.74 100.03,49.43 100.03,43.97 100.03,42.49
H1+  (via drill 0.35)
  Top 0.305: v52.81,59.59 50.72,57.51 33.43,57.51 30.96,55.04 K3.11
  Top 0.61: K1.12 K1.11 K1.10 | K3.12 K3.11 K3.10
  Top 2.54: K1.11 29.4,36.15 30.96,37.72 K3.11
  Bottom 0.305: TP12.P$1 88.87,62.59 85.19,58.9 55.14,58.9 54.46,59.59 v52.81,59.59
H1-  (via drill 0.35)
  Top 0.305: v53.54,58.85 52.99,58.85 51.14,57 37.57,57 33.96,53.39 K3.8
  Top 0.61: K1.15 K1.14 K1.13 | K3.9 K3.8 K3.7
  Top 2.54: K1.14 30.67,33.15 33.96,36.45 K3.8
  Bottom 0.305: TP13.P$1 86.89,58.39 54.18,58.39 53.72,58.85 v53.54,58.85
N$1  (via drill 0.35)
  Top 0.61: R8.2 94.07,31.61 98.12,27.56 100.1,27.56 v100.13,27.58
  Bottom 0.61: v100.13,27.58 109.73,27.58 115.21,22.1 115.49,21.82 115.49,19.68 117.44,17.74 124.52,17.74 130.43,23.65 130.43,27.94 U$1.D6
N$2
  Top 0.61: U5.15 70.14,38.61 R7.1
N$3
  Top 0.406: R1.2 81.14,48.64 80.31,47.81 80.31,45.62 79.65,44.96 U5.7 79.15,44.93 78.03,44.93 77.31,45.66 C3.1
N$4
  Top 0.406: Q1.1 81.23,36.88 80.62,36.88 80.37,37.13 80.37,38.02 79.78,38.61 U5.2
N$5
  Top 0.406: L1.2 81.32,37.86 81.36,37.82 82.25,37.82 83.36,36.7 83.36,35.93 Q1.3
  Top 0.61: U5.3 80.23,39.88 L1.2 81.32,41.3 R6.2
N$6
  Top 0.406: U5.4 79.76,41.15 80.26,41.66 80.26,42.29 80.61,42.63 | 80.61,42.63 81.45,43.47 R5.2 | R6.1 83.15,42.1 82.61,42.63 80.61,42.63
N$7
  Top 0.406: U5.6 79.78,43.69 80.37,44.27 80.37,44.68 80.99,45.3 80.99,45.87 C4.2
N$8
  Top 0.406: U5.8 79.18,50.88 C3.2 R2.2
N$14
  Top 0.813: X8.1 92.37,41.82 R8.1
PT0  (via drill 0.35)
  Top 0.305: v102.69,56.13 102.69,55.92 102.03,55.25
  Top 0.61: K1.7 23.7,40.14 22.61,40.14 14.83,47.92 14.83,57.99 17.42,60.58 96.7,60.58 102.03,55.25 K2.6
  Bottom 0.305: TP5.P$1 102.69,61.54 v102.69,56.13
PT1  (via drill 0.35)
  Top 0.305: v50.04,51.31 37.97,51.31 35.97,49.3 K3.6
  Top 0.61: K1.16 31.59,31.15 35.97,35.53 K3.6
  Bottom 0.305: TP4.P$1 101.96,59.74 101.96,41.66 101.17,40.87 95.73,40.87 94.74,41.86 94.74,46.58 94.79,46.63 90.12,51.31 v50.04,51.31
SCK  (via drill 0.35)
  Top 0.61: U5.11 v71.27,43.69
  Bottom 0.61: v71.27,43.69 71.27,47.02 72.52,48.26 82.63,48.26 85.8,45.08 85.8,39.24 95.22,29.82 114.43,29.82 117.55,32.94 122.94,32.94 131.98,41.99 134.11,41.99 U$1.D10
SERVO_DAT  (via drill 0.35)
  Top 0.305: 108.99,23.34 X6.1 108.99,23.34 | v112.55,31.72 112.55,31.22 108.99,27.66 108.99,23.34
  Top 0.61: K1.19 28.23,28.15 33.05,23.34 v33.05,22.25 | v91.59,7.06 94.89,7.06 v94.92,7.09
  Bottom 0.305: 125.76,62.97 TP7.P$1 125.76,62.97 | 125.76,62.97 125.76,52.55 129.31,49 129.31,48.49 121.18,40.36 117.88,40.36 112.55,35.03 v112.55,31.72
  Bottom 0.61: v33.05,22.25 33.05,11.46 | 33.05,11.46 33.05,7.75 35.71,5.08 89.03,5.08 91.01,7.06 v91.59,7.06 | v94.92,7.09 109.14,7.09 113.54,11.48 113.54,22.38 112.57,23.34 X6.1 | 33.05,11.46
VCC  (via drill 0.35)
  Top 0.305: v121.54,51.64 117.12,47.22 117.12,38.58 v117.37,38.33 | v113.82,34.77 113.53,34.48 v113.82,34.77
  Top 0.61: C2.1 111.76,35.09 111.76,35.04
  Top 1.016: U1.2 108.44,35.26 R4.2 111.76,35.04 | X6.2 106.5,23.19 106.5,21.06 107.29,20.27 112.04,20.27 112.04,29.46 113.89,31.32 113.89,34.11 113.53,34.48 112.92,35.09 C2.1
  Bottom 0.305: TP2.P$1 114.58,62.71 115.85,62.71 122.2,56.36 122.2,52.3 v121.54,51.64 | v113.82,34.77 v117.37,38.33
VDD  (via drill 0.35)
  Top 0.305: 73.69,34.87 73.69,37.31 U5.16
  Top 0.61: C6.1 71.3,31.37 | 71.3,31.37 C9.1 | 71.3,31.37 71.3,33.58 | 71.3,33.58 71.3,34.26 | 71.3,34.26 71.91,34.87 73.69,34.87 79.25,34.87 | 79.25,34.87 81.15,34.87 Q1.2 | 79.25,34.87 79.25,37.27 U5.1 | R7.2 70.13,35.43 71.3,34.26 | v72.92,33.5 71.37,33.5 71.3,33.58
  Bottom 0.61: v72.92,33.5 73.2,33.5 77.88,28.83 110.26,28.83 116.66,22.43 116.66,19.99 117.63,19.02 U$1.5V
X_LMT  (via drill 0.35)
  Top 0.305: 93.24,14.96 X5.1 93.24,14.96 | v123.62,53.54 125.25,51.92 125.25,15.47 119.41,9.63 92.48,9.63 90.96,11.15 90.96,12.67 93.24,14.96
  Top 0.61: K1.20 27.1,27.15 31.27,22.99 v31.27,22.28
  Bottom 0.305: 117.37,62.71 TP6.P$1 117.37,62.71 | 117.37,62.71 117.37,61.95 122.71,56.62 122.71,54.46 v123.62,53.54
  Bottom 0.61: v31.27,22.28 31.27,7.85 35.23,3.89 90.91,3.89 93.22,6.2 93.22,15.06 X5.1
Z_DIR  (via drill 0.35)
  Top 0.305: v106.4,60.5 106.4,61.47
  Top 0.61: K1.18 17.15,29.15 13.82,32.49 13.82,58.85 16.43,61.47 106.4,61.47 115.77,61.47 122.61,54.64 122.61,37.8 121.62,36.8 U$1.A1
  Bottom 0.305: TP14.P$1 v106.4,60.5
Z_OUT  (via drill 0.35)
  Top 0.61: U$1.D7 134.06,34.26 128.42,39.9 v128.42,48.79 128.42,50.34 116.36,62.41 16.1,62.41 12.95,59.26 12.95,27.5 18.32,22.14 23.7,22.14 K1.25
  Bottom 0.305: TP8.P$1 103.94,56.64 109.45,51.13 110.06,51.13 112.4,48.79 v128.42,48.79

### Text on the board
bNames: B1+ | A1+ | B0+ | A0+ | H1+ | H0+ | PT1 | Z_OUT | 24V | VCC | CF- | SERVO | B1- | A1- | B0- | A0- | 5V | H1- | H0- | PT0 | Z_DIR | GND | X_LMT | CF+ | 12V
tValues: GND | 5V | SERVO | Arduino Nano | Design By Vijay Raghav Varada / Fracktal Works
bValues: Volterra / Carriage Board / V1.1